# Altium schematic sheet X0600WRS-02-LPV01HF1_X0600WRS-02-LPV01HF.schdoc.schdoc
size 124 x 99 mm
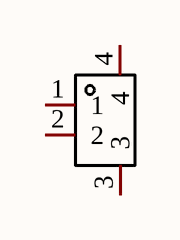
[diagram p0: X0600WRS-02-LPV01HF1_X0600WRS-02-LPV01HF.schdoc.schdoc]

## Parts
CN?  X0600WRS-02-LPV01HF  [CONN-SMD_2P-P0.60_XKB_X0600WRS-02-LPV01HF]  (value not drawn)

## Nets

Not connected (* = marked no-connect by the designer): CN? 1 2 3 4

## Library data of the parts
CN? = X0600WRS-02-LPV01HF: Manufacturer: XKB Connectivity(中国星坤); Add into BOM: yes; Pins Structure: 1x2P; Pitch: 0.6mm; Number of PINs Per Row: 2; Current Rating (Max): 200mA; Symbol: X0600WRS-02-LPV01HF; Device: X0600WRS-02-LPV01HF; LCSC Part Name: X0600WRS-02-LPV01HF; Supplier Part: C2880999; Manufacturer Part: X0600WRS-02-LPV01HF; Supplier Footprint: SMD,P=0.6mm,卧贴; JLCPCB Part Class: Extended Part; Datasheet: https://atta.szlcsc.com/upload/public/pdf/source/20211011/D66BCC430A3AF7655123579D1FADD7D5.pdf; Supplier: LCSC; Convert to PCB: yes; Mounting Style: 卧贴; Reference Series: -; Number of Pins: 2P; Number of Rows: 1; Row Spacing: -; Contact Material: 磷青铜; Contact Plating: 金; Operating Temperature Range: -25℃~+85℃